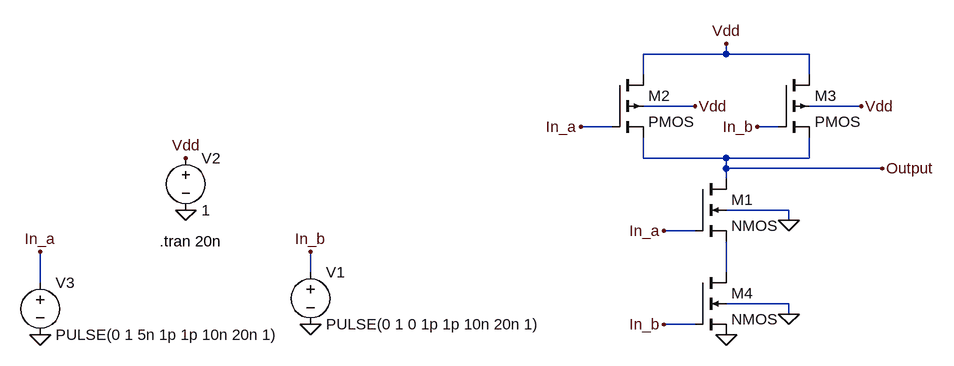
[diagram p0: schematic 1c-1.asc]
1c-1.asc, the LTspice schematic file:
Version 4
SHEET 1 1124 680
WIRE 784 -224 784 -240
WIRE 784 -224 656 -224
WIRE 912 -224 784 -224
WIRE 656 -192 656 -224
WIRE 912 -192 912 -224
WIRE 736 -144 656 -144
WIRE 992 -144 912 -144
WIRE 608 -112 560 -112
WIRE 864 -112 832 -112
WIRE 656 -64 656 -96
WIRE 784 -64 656 -64
WIRE 912 -64 912 -96
WIRE 912 -64 784 -64
WIRE 784 -48 784 -64
WIRE 1024 -48 784 -48
WIRE 784 -32 784 -48
WIRE 880 16 784 16
WIRE 880 32 880 16
WIRE 736 48 688 48
WIRE 144 112 144 80
WIRE 784 112 784 64
WIRE -272 128 -272 80
WIRE 880 160 784 160
WIRE 880 176 880 160
WIRE 736 192 688 192
FLAG 144 192 0
FLAG 1024 -48 Output
FLAG 736 -144 Vdd
FLAG 880 32 0
FLAG 688 48 In_a
FLAG -48 16 0
FLAG -48 -64 Vdd
FLAG 784 -240 Vdd
FLAG 688 192 In_b
FLAG 992 -144 Vdd
FLAG 784 208 0
FLAG 880 176 0
FLAG 832 -112 In_b
FLAG 560 -112 In_a
FLAG -272 208 0
FLAG -272 80 In_a
FLAG 144 80 In_b
SYMBOL voltage 144 96 R0
WINDOW 123 0 0 Left 0
WINDOW 39 0 0 Left 0
SYMATTR InstName V1
SYMATTR Value PULSE(0 1 0 1p 1p 10n 20n 1)
SYMBOL pmos4 608 -192 R0
SYMATTR InstName M2
SYMBOL nmos4 736 -32 R0
SYMATTR InstName M1
SYMBOL voltage -48 -80 R0
WINDOW 123 0 0 Left 0
WINDOW 39 0 0 Left 0
SYMATTR InstName V2
SYMATTR Value 1
SYMBOL pmos4 864 -192 R0
SYMATTR InstName M3
SYMBOL nmos4 736 112 R0
SYMATTR InstName M4
SYMBOL voltage -272 112 R0
WINDOW 123 0 0 Left 0
WINDOW 39 0 0 Left 0
SYMATTR InstName V3
SYMATTR Value PULSE(0 1 5n 1p 1p 10n 20n 1)
TEXT -88 64 Left 2 !.tran 20n

The netlist it stands for:
* 1c-1.asc
V1 In_b 0 PULSE(0 1 0 1p 1p 10n 20n 1)
M2 Vdd In_a Output Vdd PMOS
M1 Output In_a N001 0 NMOS
V2 Vdd 0 1
M3 Vdd In_b Output Vdd PMOS
M4 N001 In_b 0 0 NMOS
V3 In_a 0 PULSE(0 1 5n 1p 1p 10n 20n 1)
.model NMOS NMOS
.model PMOS PMOS
.lib standard.mos
.tran 20n
.backanno
.end